# EAGLE design SparkFun_Lil_Soundie_Audio_Player (EAGLE 7.7.0)
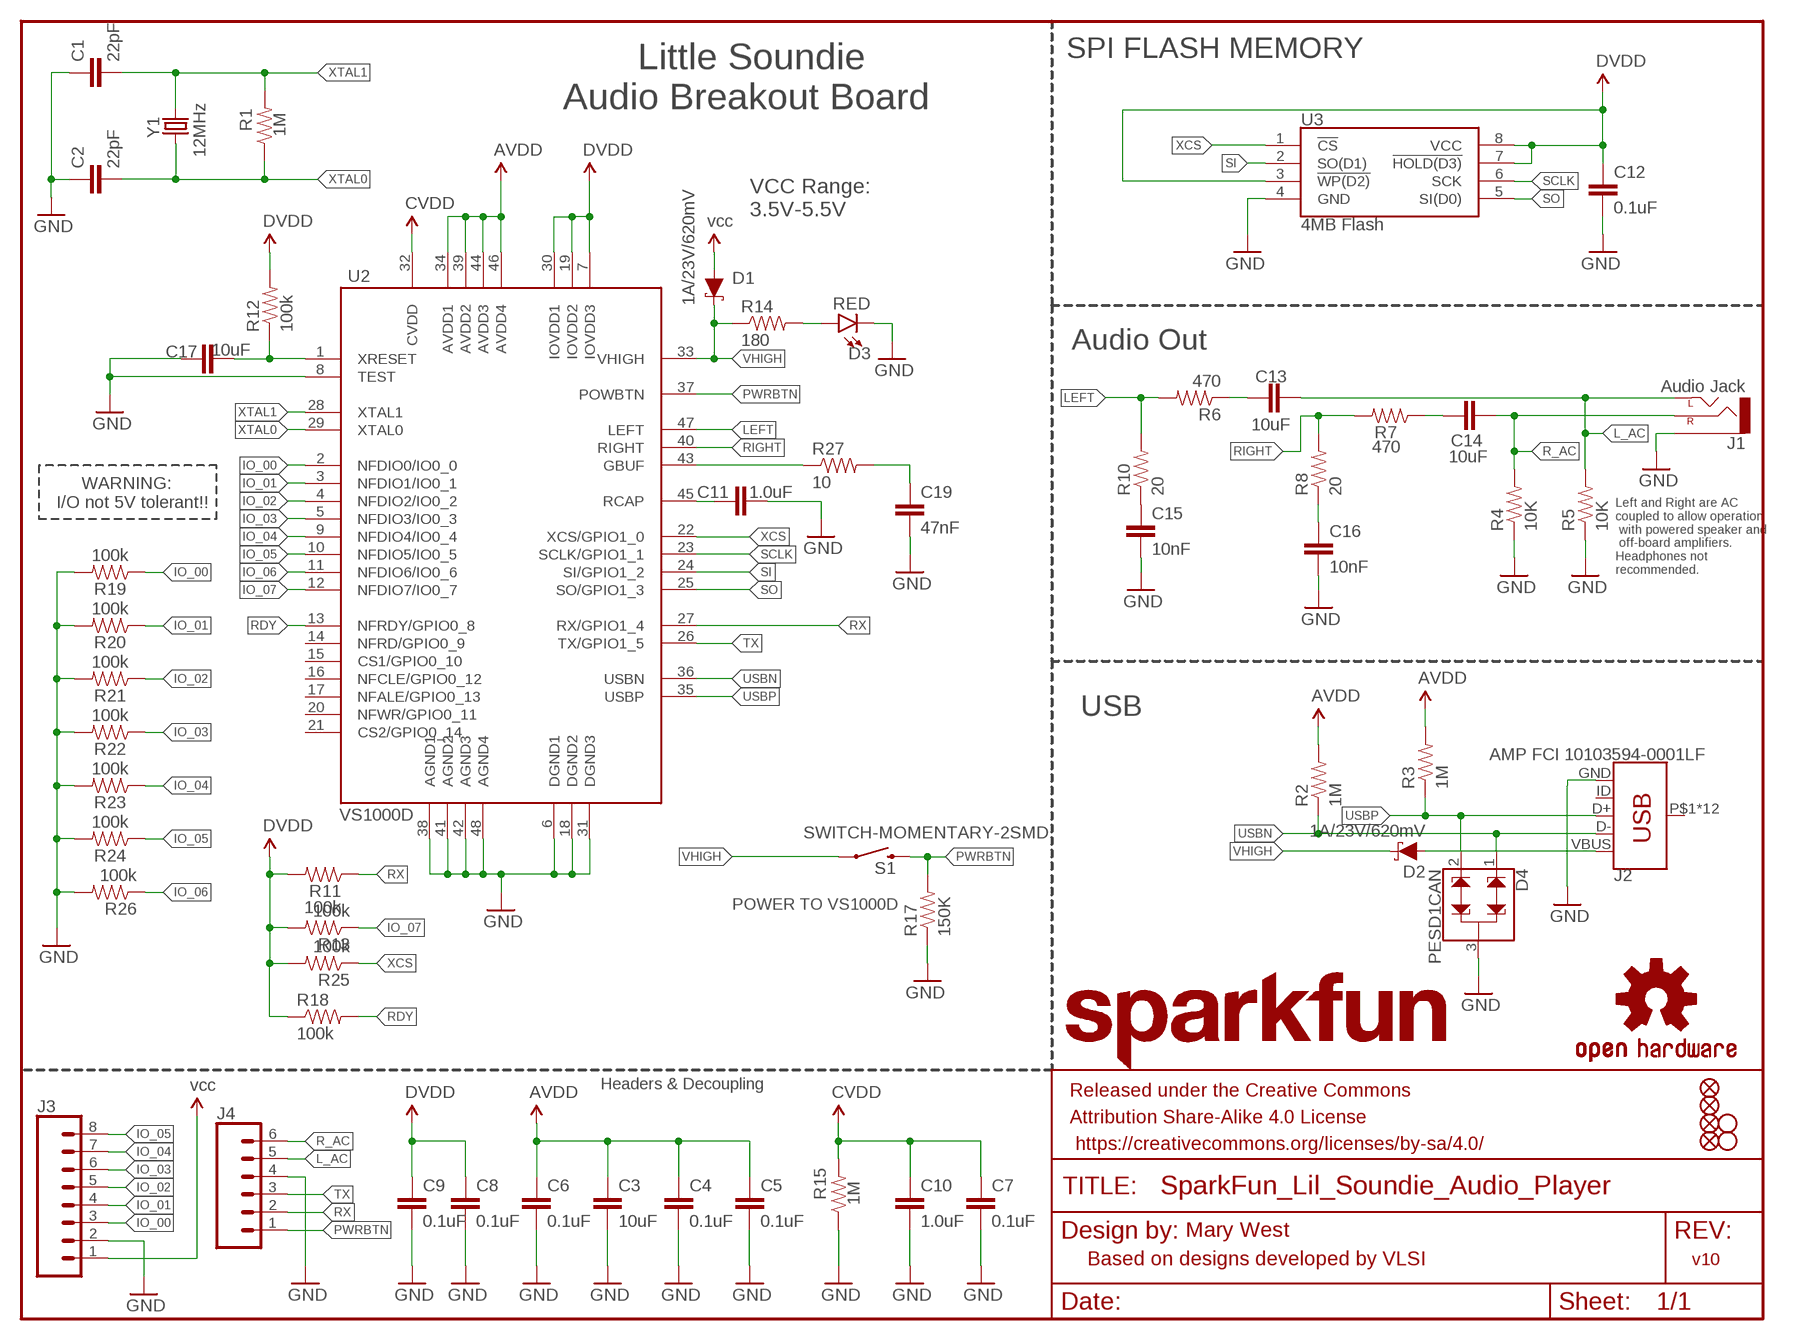
[diagram p0: schematic, sheet 1]

## Parts
C1  22pF  22PF-50V-5%(0603)  [0603-CAP]
C2  22pF  22PF-50V-5%(0603)  [0603-CAP]
C3  10uF  10UF-6.3V-20%(0603)  [0603-CAP]
C4  0.1uF  0.1UF-25V(+80/-20%)(0603)  [0603-CAP]
C5  0.1uF  0.1UF-25V(+80/-20%)(0603)  [0603-CAP]
C6  0.1uF  0.1UF-25V(+80/-20%)(0603)  [0603-CAP]
C7  0.1uF  0.1UF-25V(+80/-20%)(0603)  [0603-CAP]
C8  0.1uF  0.1UF-25V(+80/-20%)(0603)  [0603-CAP]
C9  0.1uF  0.1UF-25V(+80/-20%)(0603)  [0603-CAP]
C10  1.0uF  1.0UF-16V-10%(0603)  [0603-CAP]
C11  1.0uF  1.0UF-16V-10%(0603)  [0603-CAP]
C12  0.1uF  0.1UF-25V(+80/-20%)(0603)  [0603-CAP]
C13  10uF  10UF-6.3V-20%(0603)  [0603-CAP]
C14  10uF  10UF-6.3V-20%(0603)  [0603-CAP]
C15  10nF  10NF/10000PF-50V-10%(0603)  [0603-CAP]
C16  10nF  10NF/10000PF-50V-10%(0603)  [0603-CAP]
C17  10uF  10UF-6.3V-20%(0603)  [0603-CAP]
C19  47nF  47NF(0.047UF/47000PF)-25V-5%(0603)SMD  [0603-CAP]
D1  1A/23V/620mV  DIODE-SCHOTTKY-BAT20J  [SOD-323]
D2  1A/23V/620mV  DIODE-SCHOTTKY-BAT20J  [SOD-323]
D3  RED  LED-RED0603  [LED-0603]
D4  PESD1CAN  [SOT23-3]
FD1  FIDUCIALUFIDUCIAL  [FIDUCIAL-MICRO]
FD2  FIDUCIALUFIDUCIAL  [FIDUCIAL-MICRO]
FD3  FIDUCIALUFIDUCIAL  [FIDUCIAL-MICRO]
FD4  FIDUCIALUFIDUCIAL  [FIDUCIAL-MICRO]
FRAME1  FRAME-LETTER  [CREATIVE_COMMONS]
H1  STAND-OFFTIGHT  [STAND-OFF-TIGHT]
H4  STAND-OFFTIGHT  [STAND-OFF-TIGHT]
J1  Audio Jack  AUDIO-JACKSMD2  [AUDIO-JACK-3.5MM-SMD]
J2  AMP FCI 10103594-0001LF  USB_MICRO-B_HALF_PTH  [USB-MICROB-PTH]
J3  CONN_08"  [1X08]
J4  CONN_06SILK_FEMALE_PTH  [1X06]
LOGO1  OSHW-LOGOL  [OSHW-LOGO-L]
LOGO2  SFE_LOGO_NAME.1_INCH  [SFE_LOGO_NAME_.1]
R1  1M  1MOHM-1/10W-1%(0603)  [0603-RES]
R2  1M  1MOHM-1/10W-1%(0603)  [0603-RES]
R3  1M  1MOHM-1/10W-1%(0603)  [0603-RES]
R4  10K  10KOHM-1/10W-1%(0603)0603  [0603-RES]
R5  10K  10KOHM-1/10W-1%(0603)0603  [0603-RES]
R6  470  470OHM1/10W1%(0603)  [0603-RES]
R7  470  470OHM1/10W1%(0603)  [0603-RES]
R8  20  20OHM1/10W1%(0603)SMD  [0603-RES]
R10  20  20OHM1/10W1%(0603)SMD  [0603-RES]
R11  100k  100KOHM-1/10W-1%(0603)  [0603-RES]
R12  100k  100KOHM-1/10W-1%(0603)  [0603-RES]
R13  100k  100KOHM-1/10W-1%(0603)  [0603-RES]
R14  180  180OHM1/10W1%(0603)  [0603-RES]
R15  1M  1MOHM-1/10W-1%(0603)  [0603-RES]
R17  150K  150KOHM1/10W1%(0603)  [0603-RES]
R18  100k  100KOHM-1/10W-1%(0603)  [0603-RES]
R19  100k  100KOHM-0603-1/10W-1%  [0603]
R20  100k  100KOHM-0603-1/10W-1%  [0603]
R21  100k  100KOHM-0603-1/10W-1%  [0603]
R22  100k  100KOHM-0603-1/10W-1%  [0603]
R23  100k  100KOHM-0603-1/10W-1%  [0603]
R24  100k  100KOHM-0603-1/10W-1%  [0603]
R25  100k  100KOHM-1/10W-1%(0603)  [0603-RES]
R26  100k  100KOHM-1/10W-1%(0603)  [0603-RES]
R27  10  10OHM-1/10W-5%0603SMD  [0603-RES]
S1  SWITCH-MOMENTARY-2SMD  [TACTILE-SWITCH-SMD]
U2  VS1000D  VS1000  [LQFP-48]
U3  4MB Flash  AT25SF041  [SO08]
Y1  12MHz  CRYSTALCRYSTAL-SMD-5X3-12MHZ  [CRYSTAL-SMD-5X3]

## Nets
AVDD: C3.1 C4.1 C5.1 C6.1 R2.2 R3.2 U2.34(AVDD1) U2.39(AVDD2) U2.44(AVDD3) U2.46(AVDD4)
CVDD: C7.1 C10.1 R15.2 U2.32(CVDD)
DVDD: C8.1 C9.1 C12.1 R11.2 R12.2 R13.2 R18.1 R25.2 U2.7(IOVDD3) U2.19(IOVDD2) U2.30(IOVDD1) U3.3(!WP(D2)) U3.7(!HOLD(D3)) U3.8(VCC)
GBUF: R27.1 U2.43(GBUF)
GND: C1.1 C2.1 C3.2 C4.2 C5.2 C6.2 C7.2 C8.2 C9.2 C10.2 C11.2 C12.2 C15.2 C16.2 C17.1 C19.2 D3.C D4.3 J1.SLEEVE J2.GND J3.2 J4.4 R4.1 R5.1 R15.1 R17.1 R19.2 R20.2 R21.2 R22.2 R23.2 R24.2 R26.2 U2.6(DGND1) U2.8(TEST) U2.18(DGND2) U2.31(DGND3) U2.38(AGND1) U2.41(AGND2) U2.42(AGND3) U2.48(AGND4) U3.4(GND)
IO_00: J3.3 R19.1 U2.2(NFDIO0/IO0_0)
IO_01: J3.4 R20.1 U2.3(NFDIO1/IO0_1)
IO_02: J3.5 R21.1 U2.4(NFDIO2/IO0_2)
IO_03: J3.6 R22.1 U2.5(NFDIO3/IO0_3)
IO_04: J3.7 R23.1 U2.9(NFDIO4/IO0_4)
IO_05: J3.8 R24.1 U2.10(NFDIO5/IO0_5)
IO_06: R26.1 U2.11(NFDIO6/IO0_6)
IO_07: R13.1 U2.12(NFDIO7/IO0_7)
L_AC: C13.2 J1.TIP(LEFT) J4.5 R5.2
LEFT: R6.2 R10.2 U2.47(LEFT)
N$2: C19.1 R27.2
N$3: C13.1 R6.1
N$6: C15.1 R10.1
N$7: C11.1 U2.45(RCAP)
N$8: R11.1
N$14: C17.2 R12.1 U2.1(XRESET)
N$15: D2.A J2.VBUS
N$17: C14.1 R7.1
N$19: D3.A R14.2
N$20: C16.1 R8.1
PWRBTN: J4.1 R17.2 S1.3 U2.37(POWBTN)
R_AC: C14.2 J1.RING(RIGHT) J4.6 R4.2
RDY: R18.2 U2.13(NFRDY/GPIO0_8)
RIGHT: R7.2 R8.2 U2.40(RIGHT)
RX: J4.2 U2.27(RX/GPIO1_4)
SCLK: U2.23(SCLK/GPIO1_1) U3.6(SCK)
SI: U2.24(SI/GPIO1_2) U3.2(SO(D1))
SO: U2.25(SO/GPIO1_3) U3.5(SI(D0))
TX: J4.3 U2.26(TX/GPIO1_5)
USBN: D4.1 J2.D- R2.1 U2.36(USBN)
USBP: D4.2 J2.D+ R3.1 U2.35(USBP)
VCC: D1.A J3.1 ; supply symbol labelled vcc
VHIGH: D1.C D2.C R14.1 S1.1 U2.33(VHIGH)
XCS: R25.1 U2.22(XCS/GPIO1_0) U3.1(!CS)
XTAL0: C2.2 R1.1 U2.29(XTAL0) Y1.1
XTAL1: C1.2 R1.2 U2.28(XTAL1) Y1.3
Unconnected: J2.ID J2.P$1(SHIELD) J2.P$2(SHIELD) J2.P$3(SHIELD) J2.P$4(SHIELD) J2.P$6(SHIELD) J2.P$8(SHIELD) J2.P$10(SHIELD) J2.P$12(SHIELD) J2.SHEILD2(SHIELD) J2.SHIELD J2.SHIELD3(SHIELD) J2.SHIELD4(SHIELD) U2.14(NFRD/GPIO0_9) U2.15(CS1/GPIO0_10) U2.16(NFCLE/GPIO0_12) U2.17(NFALE/GPIO0_13) U2.20(NFWR/GPIO0_11) U2.21(CS2/GPIO0_14)

## Notes on the sheet
- SPI FLASH MEMORY
- Little Soundie
  Audio Breakout Board
- VCC Range: 
  3.5V-5.5V
- Audio Out
- WARNING:
  I/O not 5V tolerant!!
- Left and Right are AC
  coupled to allow operation
   with powered speaker and
   off-board amplifiers.
  Headphones not 
  recommended.
- USB
- POWER TO VS1000D
- Headers & Decoupling
- Mary West
- Based on designs developed by VLSI | v10

## Library data of the parts
C1 C2 = SparkFun-Capacitors:22PF-50V-5%(0603): CAP-07876; PROD_ID: CAP-07876
C3 C13 C14 C17 = SparkFun-Capacitors:10UF-6.3V-20%(0603): CAP-11015; PROD_ID: CAP-11015
C4-C9 C12 = SparkFun-Capacitors:0.1UF-25V(+80/-20%)(0603): CAP-00810 Ceramic Standard decoupling cap; PROD_ID: CAP-00810
C10 C11 = SparkFun-Capacitors:1.0UF-16V-10%(0603): CAP-00868; PROD_ID: CAP-00868
C15 C16 = SparkFun-Capacitors:10NF/10000PF-50V-10%(0603): CAP-00867; PROD_ID: CAP-00867
C19 = SparkFun-Capacitors:47NF(0.047UF/47000PF)-25V-5%(0603): CAP-08605; PROD_ID: CAP-08605
D1 D2 = SparkFun-DiscreteSemi:DIODE-SCHOTTKY: Schottky diode A Schottky diode is a semiconductor diode which has a low forward voltage drop and a very fast switching action.; PROD_ID: DIO-11623
D3 = SparkFun-LED:LED-RED: Red SMD LED Used in manufacturing of most products at SparkFun Packages: 0603 - SMD 0603 package [Product Link] <http://docs.avagotech.com/docs/AV02-0551EN> 0603 SMART - SMD 0603 SMART package ( more efficient and expensive)[Product Link] <http://www.osram-os.com/Graphics/XPic2/00077099_0.pdf> 1206 - SMD1206 package [Product Link] <https://www.sparkfun.com/datasheets/DevTools/LilyPad/Q150OVS4.pdff> SparkFun Products: Pro Mini 328 -5V <https://www.sparkfun.com/products/821> RedBoard <https://www.sparkfun.com/products/12757> IOIO-OTG <https://www.sparkfun.com/products/13613>; PROD_ID: DIO-00819
D4 = SparkFun-DiscreteSemi:PESD1CAN: CAN bus ESD protection diode PESD1CAN is used to protect two CAN bus lines from ESD. Link to datasheet <http://www.nxp.com/documents/data_sheet/PESD1CAN-U.pdf> SparkFun Products: SparkFun CAN-BUS Shield <https://www.sparkfun.com/products/13262>; PROD_ID: DIO-12501
FD1-FD4 = SparkFun-Aesthetics:FIDUCIAL: Fiducial Alignment Points Point-of-reference for pick-and-place machines and other optical instruments.
FRAME1 = SparkFun-Aesthetics:FRAME-LETTER: Schematic Frame - Letter Standard 8.5x11 US Letter frame
H1 H4 = SparkFun-Electromechanical:STAND-OFF: #4 Stand Off This is the mechanical footprint for a #4 phillips button head screw. Use the keepout ring to avoid running the screw head into surrounding components. SKU : PRT-00447
J1 = SparkFun-Connectors:AUDIO-JACK: 3.5mm Audio Jack Simple 3.5mm common PCB mount audio jack. Variant PTH is our storefront SKU PRT-08032; PROD_ID: CONN-10353
J2 = SparkFun-Connectors:USB_MICRO-B: USB Type Micro-B Connector Male/female and PTH/SMT variants SparkFun Products: SparkFun microB USB Breakout <https://www.sparkfun.com/products/12035> SparkFun USB microB Plug Breakout <https://www.sparkfun.com/products/10031> SparkFun ESP8266 Thing <https://www.sparkfun.com/products/13231>; PROD_ID: CONN-13711
J3 = SparkFun-Connectors:CONN_08: Multi connection point. Often used as Generic Header-pin footprint for 0.1 inch spaced/style header connections On any of the 0.1 inch spaced packages, you can populate with these: Break Away Headers - Straight <https://www.sparkfun.com/products/116> (PRT-00116) Break Away Male Headers - Right Angle <https://www.sparkfun.com/products/553> (PRT-00553) Female Headers <https://www.sparkfun.com/products/115> (PRT-00115) Break Away Headers - Machine Pin <https://www.sparkfun.com/products/117> (PRT-00117) Break Away Female Headers - Swiss Machine Pin <https://www.sparkfun.com/products/743> (PRT-00743) Arduino Stackable Header - 8 Pin <https://www.sparkfun.com/products/9279> (PRT-09279) For SCREWTERMINALS and SPRING TERMINALS visit here: Screw Terimnals on SparkFun.com <https://www.sparkfun.com/search/results?term=Screw+Terminals> (5mm/3.5mm/2.54mm spacing) This device is also useful as a general connection point to wire up your design to another part of your project. Our various solder wires solder well into these plated through hole pads. Hook-Up Wire - Assortment (Stranded, 22 AWG) <https://www.sparkfun.com/products/11375> (PRT-11375) Hook-Up Wire - Assortment (Solid Core, 22 AWG) <https://www.sparkfun.com/products/11367> (PRT-11367) View the entire wire category on our website here <https://www.sparkfun.com/categories/141> Special notes: Molex polarized connector foot print use with SKU : PRT-08231 with associated crimp pins and housings. 1MM SMD Version SKU: PRT-10208 NOTES ON THE VARIANTS LOCK and LOCK_LONGPADS... This footprint was designed to help hold the alignment of a through-hole component (i.e. 6-pin header) while soldering it into place. You may notice that each hole has been shifted either up or down by 0.005 of an inch from it's more standard position (which is a perfectly straight line). This slight alteration caused the pins (the squares in the middle) to touch the edges of the holes. Because they are alternating, it causes a "brace" to hold the component in place. 0.005 has proven to be the perfect amount of "off-center" position when using our standard breakaway headers. Although looks a little odd when you look at the bare footprint, once you have a header in there, the alteration is very hard to notice. Also,if you push a header all the way into place, it is covered up entirely on the bottom side.; PROD_ID: CONN-08438
J4 = SparkFun-Connectors:CONN_06: Multi connection point. Often used as Generic Header-pin footprint for 0.1 inch spaced/style header connections On any of the 0.1 inch spaced packages, you can populate with these: Break Away Headers - Straight <https://www.sparkfun.com/products/116> (PRT-00116) Break Away Male Headers - Right Angle <https://www.sparkfun.com/products/553> (PRT-00553) Female Headers <https://www.sparkfun.com/products/115> (PRT-00115) Break Away Headers - Machine Pin <https://www.sparkfun.com/products/117> (PRT-00117) Break Away Female Headers - Swiss Machine Pin <https://www.sparkfun.com/products/743> (PRT-00743) Arduino Stackable Header - 6 Pin <https://www.sparkfun.com/products/9280> (PRT-09280) For SCREWTERMINALS and SPRING TERMINALS visit here: Screw Terimnals on SparkFun.com <https://www.sparkfun.com/search/results?term=Screw+Terminals> (5mm/3.5mm/2.54mm spacing) This device is also useful as a general connection point to wire up your design to another part of your project. Our various solder wires solder well into these plated through hole pads. Hook-Up Wire - Assortment (Stranded, 22 AWG) <https://www.sparkfun.com/products/11375> (PRT-11375) Hook-Up Wire - Assortment (Solid Core, 22 AWG) <https://www.sparkfun.com/products/11367> (PRT-11367) View the entire wire category on our website here <https://www.sparkfun.com/categories/141>; PROD_ID: CONN-08437
LOGO1 = SparkFun-Aesthetics:OSHW-LOGO: Open-Source Hardware (OSHW) Logo This logo indicates the piece of hardware it is found on incorporates a OSHW license and/or adheres to the definition of open source hardware found here: http://freedomdefined.org/OSHW
LOGO2 = SparkFun-Aesthetics:SFE_LOGO_NAME: SparkFun Font Logo This is the SparkFun name logo. The logo on the schematic will always be the same size; the package variant is the height of the flame part of the logo (or the height the flame would be, if it were drawn). Default layer for the logo on the board is tSilk.
R1-R3 R15 = SparkFun-Resistors:1MOHM-1/10W-1%(0603): RES-07868; PROD_ID: RES-07868
R4 R5 = SparkFun-Resistors:10KOHM-1/10W-1%(0603): RES-00824; PROD_ID: RES-00824
R6 R7 = SparkFun-Resistors:470OHM1/10W1%(0603): RES-07869; PROD_ID: RES-07869
R8 R10 = SparkFun-Resistors:20OHM1/10W1%(0603): RES-07862; PROD_ID: RES-07862
R11-R13 R18 R25 R26 = SparkFun-Resistors:100KOHM-1/10W-1%(0603): RES-07828; PROD_ID: RES-07828
R14 = SparkFun-Resistors:180OHM1/10W1%(0603): RES-08788; PROD_ID: RES-08788
R17 = SparkFun-Resistors:150KOHM1/10W1%(0603): RES-09117; PROD_ID: RES-09117
R19-R24 = SparkFun-Resistors:100KOHM: 100kΩ resistor A resistor is a passive two-terminal electrical component that implements electrical resistance as a circuit element. Resistors act to reduce current flow, and, at the same time, act to lower voltage levels within circuits. - Wikipedia; PROD_ID: RES-07828
R27 = SparkFun-Resistors:10OHM-1/10W-5%0603: RES-09834; PROD_ID: RES-09834
S1 = SparkFun-Electromechanical:SWITCH-MOMENTARY-2: Various NO switches- pushbuttons, reed, etc; PROD_ID: SWCH-08247
U2 = SparkFun-IC-Conversion:VS1000: VS1000D Ogg Vorbis Player IC with USB and NAND FLASH Interface 12 MHz LQFP-48 Datasheet SparkFun Products Storefront component: Ogg Vorbis Codec IC - VS1000D <https://www.sparkfun.com/products/8300> (COM-08300); PROD_ID: LPA-12743
U3 = SparkFun-IC-Memory:AT25SF041: AT25SF041 4Mb Serial Flash Memory 104MHz, SPI, 8-SOIC Datasheet <http://www.adestotech.com/wp-content/uploads/DS-AT25SF041_044.pdf> SparkFun Products: SparkFun ESP8266 Thing <https://www.sparkfun.com/products/13231> SparkFun ESP8266 Thing - Dev Board <https://www.sparkfun.com/products/13711>; PROD_ID: IC-12455
Y1 = SparkFun-FreqCtrl:CRYSTAL: Various standard crystals. Proven footprints.; PROD_ID: XTAL-08297

## Board
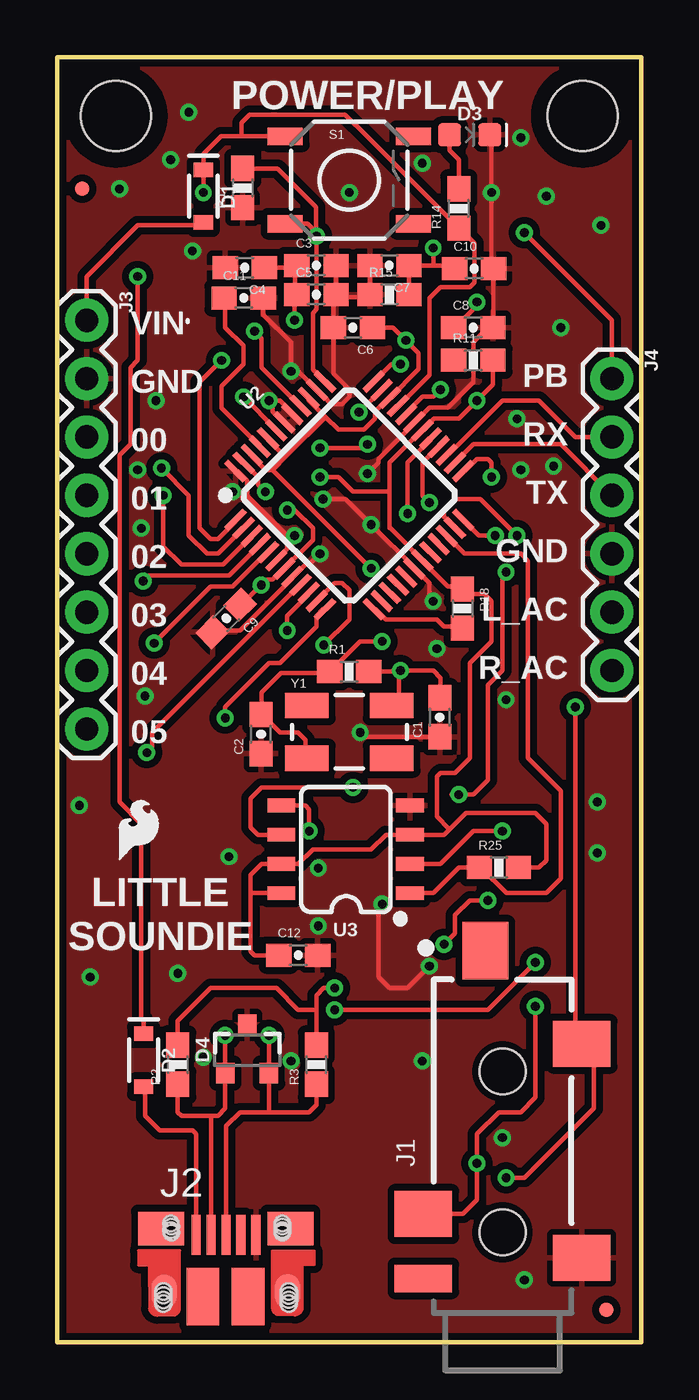
[diagram p1: board, top side]
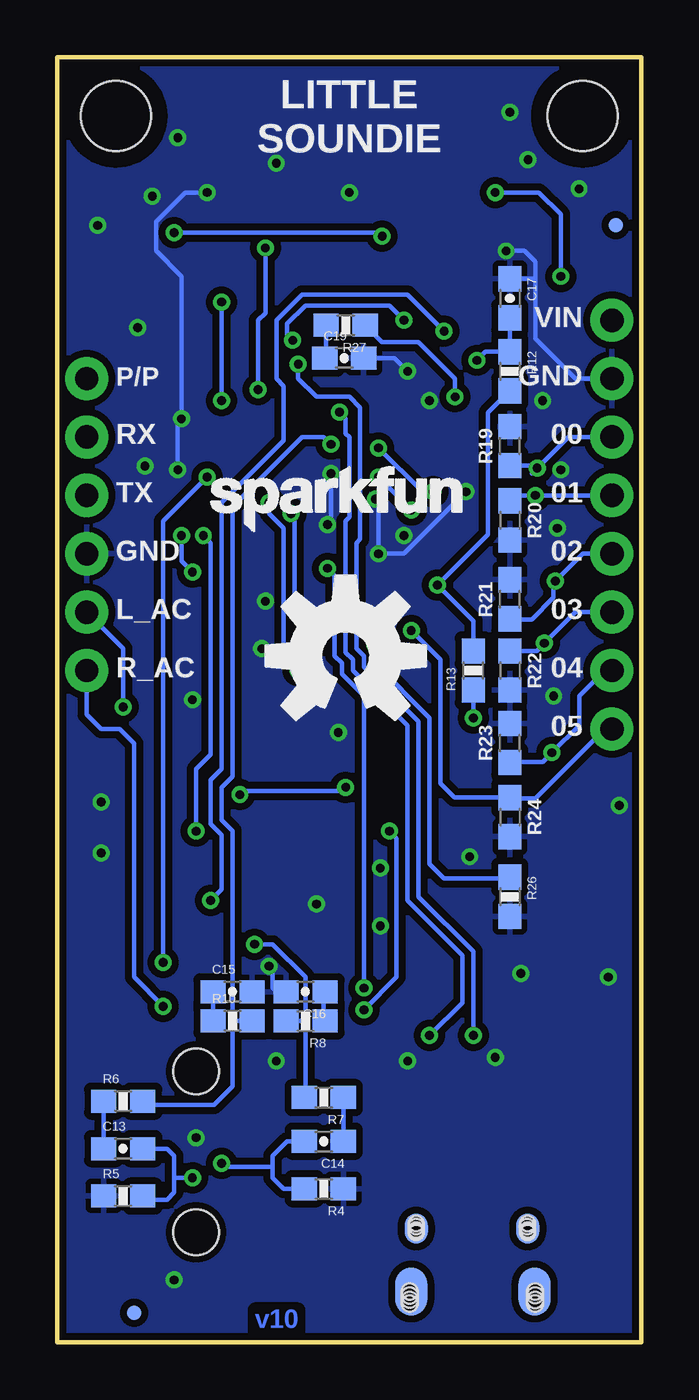
[diagram p2: board, bottom side, seen from below]

Size 25.4 x 55.88 mm. Coordinates in mm from the lower left corner, seen from the top.
Outline: 25.4,0 25.4,55.88 0,55.88 0,0 25.4,0
Copper layers (1*16): Top 0.035mm / dielectric 1.5mm / Bottom 0.035mm
Design rules "SparkFun-2-layer-TIGHT": minimum track width 7mil, minimum drill 15mil, track to track 7mil, track to pad 7mil, pad to pad 7mil, via to via 7mil, smd to smd 7mil, copper to edge 7mil, drill to drill 7mil, minimum pad ring 7mil, minimum via ring 7mil, stop-mask expansion 4mil, vias tented up to drill 25mil, thermal gap 10mil

### Footprints (pad centres in the part's own frame; a part is rotated, then mirrored left to right if it is on the bottom)
0603-CAP = smd 1.1 x 1: 1 -0.85,0; 2 0.85,0
SOD-323 = smd 0.63 x 0.83: A 1.15,0; C -1.15,0
LED-0603 = smd 1 x 1: A -0.877,0; C 0.877,0
SOT23-3 = smd 0.8 x 0.9: 1 -0.95,-1; 2 0.95,-1; 3 0,1.1
FIDUCIAL-MICRO = smd 0.635 x 0.635: 1 0,0
STAND-OFF-TIGHT = hole 3.048: 0,0
AUDIO-JACK-3.5MM-SMD = smd 2 x 2.5: RING 4.3,3.45; SLEEVE 2.4,-3.45; TIP 11.7,-3.45 | smd 1.2 x 2.5: RSH 1.5,3.45 | smd 2.5 x 2: TSH 15.75,0.75 | hole 2: 3.5,0; 10.5,0
USB-MICROB-PTH = smd 0.4 x 1.75: D+ 0.031,1.331; D- -0.619,1.331; GND 1.331,1.331; ID 0.681,1.331; VBUS -1.269,1.331 | smd 1.4 x 2.1 bottom: P$1 2.701,-1.142; P$3 -2.659,-1.144 | smd 1 x 1.3: P$2 2.487,1.594; P$6 -2.368,1.604 | smd 1 x 1.3 bottom: P$4 -2.368,1.604; P$10 2.481,1.598 | smd 1.1 x 1.5: P$8 2.701,-1.142; P$12 -2.659,-1.144 | smd 2 x 1.46: SHEILD2 2.831,1.606; SHIELD -2.794,1.606 | smd 1.425 x 2.5: SHIELD3 -0.979,-1.349; SHIELD4 0.996,-1.352 | hole 0.7: -2.693,-1.134; -2.693,-1.3; -2.694,-1.499; -2.694,-1.664; 2.768,-1.134; 2.767,-1.303; 2.766,-1.496; 2.766,-1.664 | hole 0.66: -2.359,1.821; -2.349,1.691; -2.359,1.541; -2.354,1.432; 2.481,1.821; 2.491,1.691; 2.481,1.541; 2.486,1.432
1X08 = drill 1.016 pad 1.88: 1 0,0; 2 2.54,0; 3 5.08,0; 4 7.62,0; 5 10.16,0; 6 12.7,0; 7 15.24,0; 8 17.78,0
1X06 = drill 1.016 pad 1.88: 1 0,0; 2 2.54,0; 3 5.08,0; 4 7.62,0; 5 10.16,0; 6 12.7,0
0603-RES = smd 1.1 x 1: 1 -0.85,0; 2 0.85,0
0603 = smd 1.1 x 1: 1 -0.85,0; 2 0.85,0
TACTILE-SWITCH-SMD = smd 1.524 x 0.762: 1 -2.794,1.905; 2 2.794,1.905; 3 -2.794,-1.905; 4 2.794,-1.905
LQFP-48 = smd 0.254 x 1.143: 1 -2.75,-4.25; 2 -2.25,-4.25; 3 -1.75,-4.25; 4 -1.25,-4.25; 5 -0.75,-4.25; 6 -0.25,-4.25; 7 0.25,-4.25; 8 0.75,-4.25; 9 1.25,-4.25; 10 1.75,-4.25; 11 2.25,-4.25; 12 2.75,-4.25; 25 2.75,4.25; 26 2.25,4.25; 27 1.75,4.25; 28 1.25,4.25; 29 0.75,4.25; 30 0.25,4.25; 31 -0.25,4.25; 32 -0.75,4.25; 33 -1.25,4.25; 34 -1.75,4.25; 35 -2.25,4.25; 36 -2.75,4.25 | smd 1.143 x 0.254: 13 4.25,-2.75; 14 4.25,-2.25; 15 4.25,-1.75; 16 4.25,-1.25; 17 4.25,-0.75; 18 4.25,-0.25; 19 4.25,0.25; 20 4.25,0.75; 21 4.25,1.25; 22 4.25,1.75; 23 4.25,2.25; 24 4.25,2.75; 37 -4.25,2.75; 38 -4.25,2.25; 39 -4.25,1.75; 40 -4.25,1.25; 41 -4.25,0.75; 42 -4.25,0.25; 43 -4.25,-0.25; 44 -4.25,-0.75; 45 -4.25,-1.25; 46 -4.25,-1.75; 47 -4.25,-2.25; 48 -4.25,-2.75
SO08 = smd 0.6 x 1.2: 1 -1.905,-2.8; 2 -0.635,-2.8; 3 0.635,-2.8; 4 1.905,-2.8; 5 1.905,2.8; 6 0.635,2.8; 7 -0.635,2.8; 8 -1.905,2.8
CRYSTAL-SMD-5X3 = smd 1.9 x 1.1: 1 -1.85,-1.15; 2 1.85,-1.15; 3 1.85,1.15; 4 -1.85,1.15

### Placement (x,y rotation side)
C1  16.64,27.18 90 top
C2  8.86,26.45 90 top
C3  11.27,46.83 0 top
C4  8.15,46.74 180 top
C5  11.27,45.56 0 top
C6  12.86,44.13 180 top
C7  14.45,46.83 180 top
C8  18.1,44.13 0 top
C9  7.35,31.48 225 top
C10  18.13,46.69 0 top
C11  8.1,45.42 0 top
C12  10.48,16.83 0 top
C13  22.54,8.41 0 bottom
C14  13.81,8.73 180 bottom
C15  17.78,15.24 0 bottom
C16  14.61,15.24 180 bottom
C17  5.71,45.4 270 bottom
C19  12.92,42.8 0 bottom
D1  6.35,49.85 270 top
D2  3.75,12.26 270 top
D3  17.94,52.51 0 top
D4  8.26,12.7 0 top
FD1  23.88,1.4 270 top
FD2  1.08,50.16 270 top
FD3  22.07,1.27 0 bottom
FD4  1.11,48.58 0 bottom
FRAME1  -15.56,-13.49 0 top  (outside the outline)
H1  2.54,53.34 270 top
H4  22.86,53.34 270 top
J1  19.37,1.27 90 top
J2  7.3,3.33 0 top
J3  1.27,44.45 270 top
J4  24.13,41.91 270 top
LOGO1  12.86,29.84 0 bottom
LOGO2  19.21,34.77 0 bottom
R1  12.7,29.16 0 top
R2  5.24,12.06 90 top
R3  11.27,12.06 90 top
R4  13.81,6.67 180 bottom
R5  22.54,6.35 0 bottom
R6  22.54,10.48 0 bottom
R7  13.81,10.64 180 bottom
R8  14.61,13.97 180 bottom
R10  17.78,13.97 0 bottom
R11  18.1,42.7 0 top
R12  5.71,42.23 270 bottom
R13  7.3,29.21 90 bottom
R14  17.46,49.31 90 top
R15  14.45,45.56 0 top
R17  8.06,50.2 90 top
R18  17.62,31.91 270 top
R19  5.71,38.98 90 bottom
R20  5.71,35.74 270 bottom
R21  5.71,32.31 90 bottom
R22  5.71,29.21 270 bottom
R23  5.71,26.06 90 bottom
R24  5.71,22.83 270 bottom
R25  19.21,20.64 0 top
R26  5.71,19.37 270 bottom
R27  12.86,44.23 180 bottom
S1  12.7,50.55 0 top
U2  12.7,36.83 315 top
U3  12.54,21.43 90 top
U$1  [SFE_LOGO_FLAME_.1]  2.38,20.64 0 top
Y1  12.7,26.54 0 top

### Tracks (layer width: path | path; a pad name or v marks a point on that pad's centre or on a via)
AVDD  (via drill 0.38)
  Top 0.203: C4.1 10.33,46.74 | 10.33,46.74 C3.1 | 10.33,46.74 10.33,45.65 C5.1 10.32,45.46 v10.32,44.45 | 11.59,12.86 11.27,13.18 11.11,13.18 11.27,13.02 R3.2 11.27,14.45 | C6.1 14.61,44.13 v15.16,43.58 15.72,43.02 15.72,42.32 U2.34 14.4,41.07 13.81,40.48 13.81,40.16 13.34,39.69 12.22,39.69 11.67,40.24 | v13.65,33.66 9.37,37.94 | 8.39,38.6 U2.46 8.46,38.53 9.05,37.94 9.37,37.94 | v12.06,15.4 11.59,15.4 11.27,15.08 11.27,14.45 | R2.2 5.24,13.97 6.67,15.4 9.53,15.4 10.48,14.45 11.27,14.45 | U2.39 10.93,40.98 11.67,40.24 | U2.44 9.16,39.25 9.84,38.58 10,38.58 | 10,38.58 11.67,40.24 | 10,38.58 9.37,37.94
  Bottom 0.203: v12.06,15.4 12.06,28.1 13.02,29.05 13.02,29.53 13.34,29.84 13.34,33.34 v13.65,33.66 | v10.32,44.45 10.95,45.09 14.61,45.09 15.4,44.29 15.4,43.81 v15.16,43.58
CVDD  (via drill 0.38)
  Top 0.203: R15.2 C7.1 16.35,46.83 | U2.32 15.18,40.42 15.88,41.12 16.35,41.12 v16.67,41.43 | 16.35,46.83 17.14,46.83 C10.1 | v16.35,47.59 16.35,46.83
  Bottom 0.203: v16.35,47.59 16.35,44.77 16.67,44.45 v16.67,41.43
DVDD  (via drill 0.38)
  Top 0.203: U2.7 9.87,33.68 | U2.30 15.88,39.69 | v18.26,45.24 18.26,45.09 17.3,44.13 C8.1 | U2.30 15.85,39.66 14.45,38.26 14.45,36.99 | U2.30 16.39,40.16 17.46,40.16 v18.26,40.96 18.95,41.65 R11.2 | U2.7 11.11,34.89 11.11,35.4 10.32,36.2 v10,36.2 | 14.45,36.99 14.45,35.4 14.48,35.4 U2.19 15.88,33.97 16.99,32.86 17.52,32.86 R18.1 17.62,32.54 18.57,32.54 18.89,32.23 18.89,30.48 17.94,29.53 17.94,25.4 17.3,24.77 16.67,24.77 16.51,24.61 16.51,22.86 17.07,22.3 | C9.1 8.02,32.08 v8.87,32.93 9.12,33.18 9.37,33.18 9.84,33.65 U2.7 | v11.43,37.62 12.22,37.62 12.86,36.99 14.45,36.99 | 17.07,22.3 16.83,22.07 U3.3 14.29,22.07 13.65,21.43 11.11,21.43 10.48,20.8 U3.7 8.89,20.8 8.41,20.32 8.41,19.53 | 17.07,22.3 17.78,23.02 20.8,23.02 21.27,22.54 21.27,20.95 20.95,20.64 R25.2 | 8.41,19.53 8.41,16.99 8.57,16.83 C12.1 | U3.8 8.41,19.53
  Bottom 0.203: v11.43,37.62 v10,36.2 | v18.26,40.96 v18.26,45.24 | 8.64,33.16 v8.87,32.93 | R12.2 6.67,40.42 6.67,35.13 v8.87,32.93 | R13.2 7.3,31.36 v8.87,32.93
GBUF  (via drill 0.38)
  Top 0.203: U2.43 9.52,39.69 v8.1,41.12
  Bottom 0.203: R27.1 11.27,43.5 9.68,43.5 8.1,41.91 v8.1,41.12
GND  (via drill 0.38)
  Top 0.203: 12.01,45.45 C6.2 12.01,42.12 12.7,41.43 12.7,41.12 12.38,40.8 11.91,40.8 11.75,40.96 U2.38 10.48,42.23 v10.16,42.23 10.16,43.5 8.95,44.7 C11.2 8.88,45.42 | 12.01,45.45 C5.2 C3.2 | 7.14,46.9 C4.2 | 12.01,45.45 13.48,45.45 R15.1 C7.2 | 18.89,52.86 v18.89,50.01 18.89,46.78 C10.2 18.98,44.16 C8.2 18.73,44.13 18.1,43.5 18.1,41.75 16.99,40.64 16.19,40.64 15.56,40.01 U2.31 15.53,39.98 13.97,38.42 13.97,38.26 v13.49,37.78 | C4.2 7.39,46.74 | U2.42 9.84,40.01 9.37,40.48 9.37,40.8 v9.21,40.96 9.68,40.96 10.22,40.42 U2.41 | 6.83,30.96 7.94,30.96 10.22,33.24 U2.8 10.28,33.29 10.79,33.81 10.95,33.81 v11.43,34.29 | 6.83,30.96 C9.2 | 9.55,34 U2.6 10,34.48 10,35.08 8.26,36.83 | v16.35,32.23 16.19,32.38 16.19,33.02 15.56,33.65 U2.18 15.53,33.68 v13.65,35.56 12.54,36.67 v11.56,36.67 | D4.3 8.26,14.13 | 6.83,30.96 6.51,30.96 | v16.19,16.35 15.24,15.4 14.45,15.4 13.97,15.88 13.97,18.89 v14.13,19.05 | 7.7,37.94 U2.48 7.83,37.89 8.26,37.47 8.26,36.83 | 8.26,36.83 7.78,36.83 v7.62,36.99 | C1.1 13.36,26.33 v13.18,26.51 | C4.2
  Bottom 0.203: J3.2 2.86,41.91 4.6,43.66 4.6,46.2 | v20.16,37.94 20.16,40.01 v20,40.16 20,46.35 21.11,47.47 21.11,48.74 19.84,50.01 v18.89,50.01 | v10.16,42.23 10.73,42.8 C19.2 | v5.87,47.47 5.08,47.47 4.6,46.99 4.6,46.2 | v13.49,37.78 13.49,35.72 v13.65,35.56 | C16.2 15.88,15.24 16.03,15.4 16.03,16.35 v16.19,16.35 | v7.62,36.99 10.32,34.29 v11.43,34.29 11.43,36.54 v11.56,36.67 | C17.1 4.66,46.25 4.6,46.2
  other vias: 19.53,27.94 23.5,21.27 16.51,30.16 6.35,12.38 10.16,12.22 23.5,23.5 3.49,37.94 4.29,40.96 11.35,20.62 11.35,18.1 7.46,21.11 3.81,28.1 15.88,12.22 10.32,35.08 4.92,51.44 5.71,53.5 20.16,52.39 21.27,49.85 23.65,48.58 21.91,44.13 21.59,38.1 1.43,15.88 5.24,16.03 0.95,23.34 2.7,50.16 3.65,35.4 12.7,50.01 15.88,51.28 19.37,8.89 20.32,2.7
  pour Top (isolate 0.305): 0,55.88 25.4,55.88 25.4,0 0,0
  pour Bottom (isolate 0.305): 0,55.88 25.4,55.88 25.4,0 0,0
IO_00  (via drill 0.38)
  Top 0.203: U2.2 8.1,35.41 6.99,34.29 6.51,34.29 5.71,35.08 5.71,36.83 v4.52,38.02
  Bottom 0.203: J3.3 3.17,39.37 v4.52,38.02 | v4.52,38.02 4.76,37.78 | R19.1 4.63,38.13 v4.52,38.02
IO_01  (via drill 0.38)
  Top 0.203: v4.6,36.83 4.6,34.61 5.4,33.81 7.21,33.81 U2.3
  Bottom 0.203: J3.4 v4.6,36.83 5.47,36.83 R20.1
IO_02  (via drill 0.38)
  Top 0.203: U2.4 8.81,34.69 7.46,33.34 3.97,33.34 v3.73,33.1
  Bottom 0.203: R21.1 5.69,31.43 4.76,31.43 3.81,32.38 3.81,33.02 v3.73,33.1 2.54,34.29 J3.5
IO_03  (via drill 0.38)
  Top 0.203: U2.5 9.11,34.35 7.62,32.86 6.67,32.86 v4.21,30.4
  Bottom 0.203: J3.6 2.86,31.75 v4.21,30.4 4.55,30.06 R22.1
IO_04  (via drill 0.38)
  Top 0.203: U2.9 10.56,32.94 4.13,26.51 4.13,25.88 v3.89,25.64
  Bottom 0.203: R23.1 5.68,25.24 4.29,25.24 v3.89,25.64 2.7,26.83 2.7,28.1 1.59,29.21 J3.7
IO_05  (via drill 0.38)
  Top 0.203: U2.10 10.93,32.52 10,31.59 v10,30.96
  Bottom 0.203: J3.8 1.59,26.67 4.6,23.65 5.68,23.65 R24.1 8.13,23.68 8.73,24.29 8.73,29.69 v10,30.96
IO_06  (via drill 0.38)
  Top 0.203: v11.59,30.32 12.7,31.43 12.7,32.7 12.38,33.02 12.06,33.02 U2.11
  Bottom 0.203: v11.59,30.32 11.59,29.53 9.21,27.15 9.21,20.8 8.57,20.16 5.77,20.16 R26.1
IO_07  (via drill 0.38)
  Top 0.203: v7.3,27.15 7.3,27.62 9.21,29.53 9.68,29.53 11.27,31.11 11.27,31.59 11.56,31.88 U2.12
  Bottom 0.203: R13.1 v7.3,27.15
L_AC  (via drill 0.38)
  Top 0.203: v22.54,27.62 22.54,13.24 J1.TIP 23.34,12.45 23.34,10.16 20.32,7.14 v19.53,7.14
  Bottom 0.203: v22.54,27.62 22.54,30.16 J4.5 | C13.2 20.64,8.41 20.32,8.1 20.32,7.14 | 20.32,7.14 20.32,6.51 20.64,6.19 21.53,6.19 R5.2 | v19.53,7.14 20.32,7.14
LEFT  (via drill 0.38)
  Top 0.203: U2.47 8.11,38.24 8.73,37.62 8.73,37.31 v9.05,36.99 | v11.43,38.89 13.34,38.89 v13.49,39.05
  Bottom 0.203: v13.49,39.05 13.81,39.37 14.76,39.37 17.78,36.35 17.78,24.61 18.26,24.13 18.26,22.7 17.78,22.23 17.78,13.97 | v9.05,36.99 9.53,36.99 v11.43,38.89 | R10.2 17.78,13.97 | 17.78,13.97 17.78,11.11 18.57,10.32 21.53,10.32 R6.2
N$2
  Bottom 0.203: R27.2 13.71,42.86 C19.1
N$3
  Bottom 0.203: R6.1 C13.1
N$6
  Bottom 0.203: C15.1 R10.1
N$7
  Top 0.203: C11.1 7.3,45.37 7.3,44.13 8.1,43.34 8.1,42.55 7.14,41.59 7.14,40.62 U2.45
N$14  (via drill 0.38)
  Top 0.203: U2.1 7.75,35.69 6.99,34.92 6.67,34.92 6.19,35.4 6.19,41.75 v7.14,42.7
  Bottom 0.203: C17.2 R12.1 6.77,43.08 v7.14,42.7
N$15
  Top 0.203: D2.A 3.81,11.04 3.81,9.84 4.45,9.21 5.87,9.21 6.03,9.05 J2.VBUS
N$17
  Bottom 0.203: R7.1 C14.1
N$19
  Top 0.203: D3.A 17.06,51.84 17.46,51.44 R14.2
N$20
  Bottom 0.203: C16.1 13.81,15.24 13.81,13.97 R8.1
PWRBTN  (via drill 0.38)
  Top 0.203: 9.84,48.7 S1.3 10.89,48.64 11.27,48.26 v11.27,48.1 | v11.27,48.1 11.27,44.93 11.11,44.77 11.11,42.31 U2.37 | J4.1 24.13,44.45 v20.32,48.26 | R17.2 9.57,51.05 11.25,49.37 11.25,48.12 v11.27,48.1
  Bottom 0.203: v20.32,48.26 11.43,48.26 v11.27,48.1
R_AC  (via drill 0.38)
  Top 0.203: 15.93,5.56 J1.RING | J1.RING 17.64,5.57 18.26,6.19 v18.26,7.78 18.26,9.05 19.21,10 20.16,10 20.8,10.64 v20.8,14.61 | 15.9,5.56 J1.RING
  Bottom 0.203: J4.6 24.13,27.3 23.5,26.67 22.7,26.67 22.07,26.04 22.07,15.88 v20.8,14.61 | C14.2 15.4,8.73 16.03,8.1 16.03,7.62 | R4.2 15.56,6.67 16.03,7.14 16.03,7.62 | 16.03,7.62 18.1,7.62 v18.26,7.78
RDY
  Top 0.203: U2.13 13.84,31.88 14.29,31.43 16.51,31.43 16.83,31.11 17.57,31.11 R18.2
RIGHT  (via drill 0.38)
  Top 0.203: 8.59,43.95 v8.57,43.97 8.89,43.66 8.89,42.39 10.56,40.72 U2.40 | v18.73,19.21 17.94,19.21 17.3,18.57 17.3,17.78 v16.83,17.3
  Bottom 0.203: v8.57,43.97 10.16,45.56 14.76,45.56 15.88,44.45 15.88,41.91 15.56,41.59 15.56,39.21 18.26,36.51 18.26,24.92 18.73,24.45 18.73,22.54 18.26,22.07 18.26,19.68 v18.73,19.21 | 14.61,13.97 14.61,15.88 16.03,17.3 v16.83,17.3 16.67,17.3 | R8.2 14.61,13.97 | 14.61,13.97 14.61,10.69 R7.2
RX
  Top 0.203: J4.2 22.54,39.37 20.95,40.96 19.37,40.96 17.01,38.6 U2.27
SCLK  (via drill 0.38)
  Top 0.203: v20,35.08 18.41,36.67 17.3,36.67 16.83,36.2 16.83,35.88 U2.23 | v19.53,33.5 19.37,33.34 19.37,29.21 18.73,28.57 18.73,24.45 18.1,23.81 v17.46,23.81 17.14,23.81 | U3.6 8.73,22.07 8.41,22.38 8.41,23.65 8.89,24.13 v12.86,24.13
  Bottom 0.203: v20,35.08 20,33.97 v19.53,33.5 | v12.86,24.13 13.02,23.97 17.3,23.97 v17.46,23.81
SI  (via drill 0.38)
  Top 0.203: v19.05,35.08 18.34,35.08 U2.24 | U3.2 16.67,20.8 18.1,22.23 v19.37,22.23
  Bottom 0.203: v19.05,35.08 18.73,34.77 18.73,25.56 19.37,24.92 v19.37,22.23
SO  (via drill 0.38)
  Top 0.203: v20.8,16.51 18.73,14.45 v12.06,14.45 | U2.25 17.73,37.89 18.26,38.42 18.73,38.42 18.89,38.26 v18.89,37.62 | U3.5 10.79,23.34 10.95,23.18 v10.95,22.23
  Bottom 0.203: v20.8,16.51 20.8,35.72 v18.89,37.62 | v12.06,14.45 10.64,15.88 10.64,21.91 v10.95,22.23
TX
  Top 0.203: U2.26 18.1,39.05 21.91,39.05 J4.3
USBN  (via drill 0.38)
  Top 0.203: R2.1 5.24,10 5.4,9.84 6.67,9.84 | 6.67,9.84 6.83,9.84 | 6.83,9.84 6.99,9.84 7.3,10.16 D4.1 v7.3,13.33 v7.3,13.34 | 6.82,9.84 6.83,9.84 | v14.92,42.55 14.53,42.55 U2.36 | J2.D- 6.68,9.83 6.67,9.84
  Bottom 0.203: v7.3,13.34 7.3,16.99 9.68,19.37 9.68,26.99 12.06,29.37 12.06,29.84 12.38,30.16 12.38,34.77 12.22,34.92 12.22,40.64 12.7,41.12 14.13,41.12 14.92,41.91 v14.92,42.55
USBP  (via drill 0.38)
  Top 0.203: 9.21,10 7.94,10 7.33,9.4 J2.D+ | 9.21,10 10.95,10 11.27,10.32 R3.1 | U2.35 14.11,41.42 14.1,41.42 v13.13,40.45 | 9.21,10 D4.2 v9.21,13.33 v9.21,13.34
  Bottom 0.203: v9.21,13.34 7.78,14.76 7.78,16.83 10.16,19.21 10.16,26.83 12.54,29.21 12.54,29.69 12.86,30 12.86,35.72 12.7,35.88 12.7,39.37 12.86,39.53 12.86,40.16 13.13,40.43 v13.13,40.45
VCC
  Top 0.203: J3.1 1.27,46.35 3.49,48.58 6.23,48.58 D1.A
VHIGH  (via drill 0.38)
  Top 0.203: 6.35,51.12 6.35,51.69 7.11,52.45 8.02,52.45 | 13.47,52.45 R14.1 17.5,48.46 18.15,47.81 18.15,46.09 17.94,45.88 16.67,45.88 16.19,45.4 16.19,42.07 14.84,40.72 U2.33 | 6.35,51.12 6.51,50.96 | 6.35,51.12 D1.C v6.35,50.01 | D2.C 3.75,14.03 3.65,14.13 3.65,22.54 2.7,23.5 2.7,38.58 3.17,39.05 3.17,42.39 3.49,42.7 v3.49,46.35 | 9.84,52.51 S1.1 8.02,52.45 | 13.47,52.45 | 13.47,52.45 12.52,53.4 8.37,53.4 8.02,53.05 8.02,52.45
  Bottom 0.203: v3.49,46.35 3.49,49.05 4.45,50.01 v6.35,50.01
XCS
  Top 0.203: U2.22 17.71,34.29 20.16,34.29 20.48,33.97 20.48,25.4 21.91,23.97 21.91,20.16 21.27,19.53 19.53,19.53 18.41,20.64 R25.1 17.46,20.64 16.35,19.53 U3.1
XTAL0  (via drill 0.38)
  Top 0.203: Y1.1 10.79,25.45 10.79,26.19 10.48,26.51 9.68,26.51 8.9,27.3 C2.2 8.89,27.33 8.89,28.26 9.74,29.11 11.85,29.11 R1.1 13.18,30.48 v14.13,30.48 | U2.29 16.24,39.25 15.24,38.26 v15.24,36.04
  Bottom 0.203: v15.24,36.04 15.08,35.88 15.08,31.43 v14.13,30.48
XTAL1  (via drill 0.38)
  Top 0.203: U2.28 16.57,38.95 15.88,38.26 15.88,36.83 v16.19,36.51 | R1.2 14.87,29.16 | 14.87,29.16 v14.92,29.21 16.35,29.21 16.67,28.89 16.67,28.06 C1.2 | 14.87,29.16 14.87,28.02 Y1.3
  Bottom 0.203: v16.19,36.51 16.19,36.04 15.56,35.4 15.56,29.84 v14.92,29.21

### Text on the board
Bottom: v10
tPlace: POWER/PLAY | VIN | PB | GND | RX | 00 | TX | 01 | GND | 02 | L_AC | 03 | R_AC | 04 | 05 | LITTLE / SOUNDIE
bPlace: LITTLE / SOUNDIE | VIN | GND | P/P | 00 | RX | 01 | TX | 02 | GND | 03 | L_AC | 04 | R_AC | 05
Measures: All Units Inches
tDocu: Mary West